# Altium project DCDCProtoNeg.PrjPCB
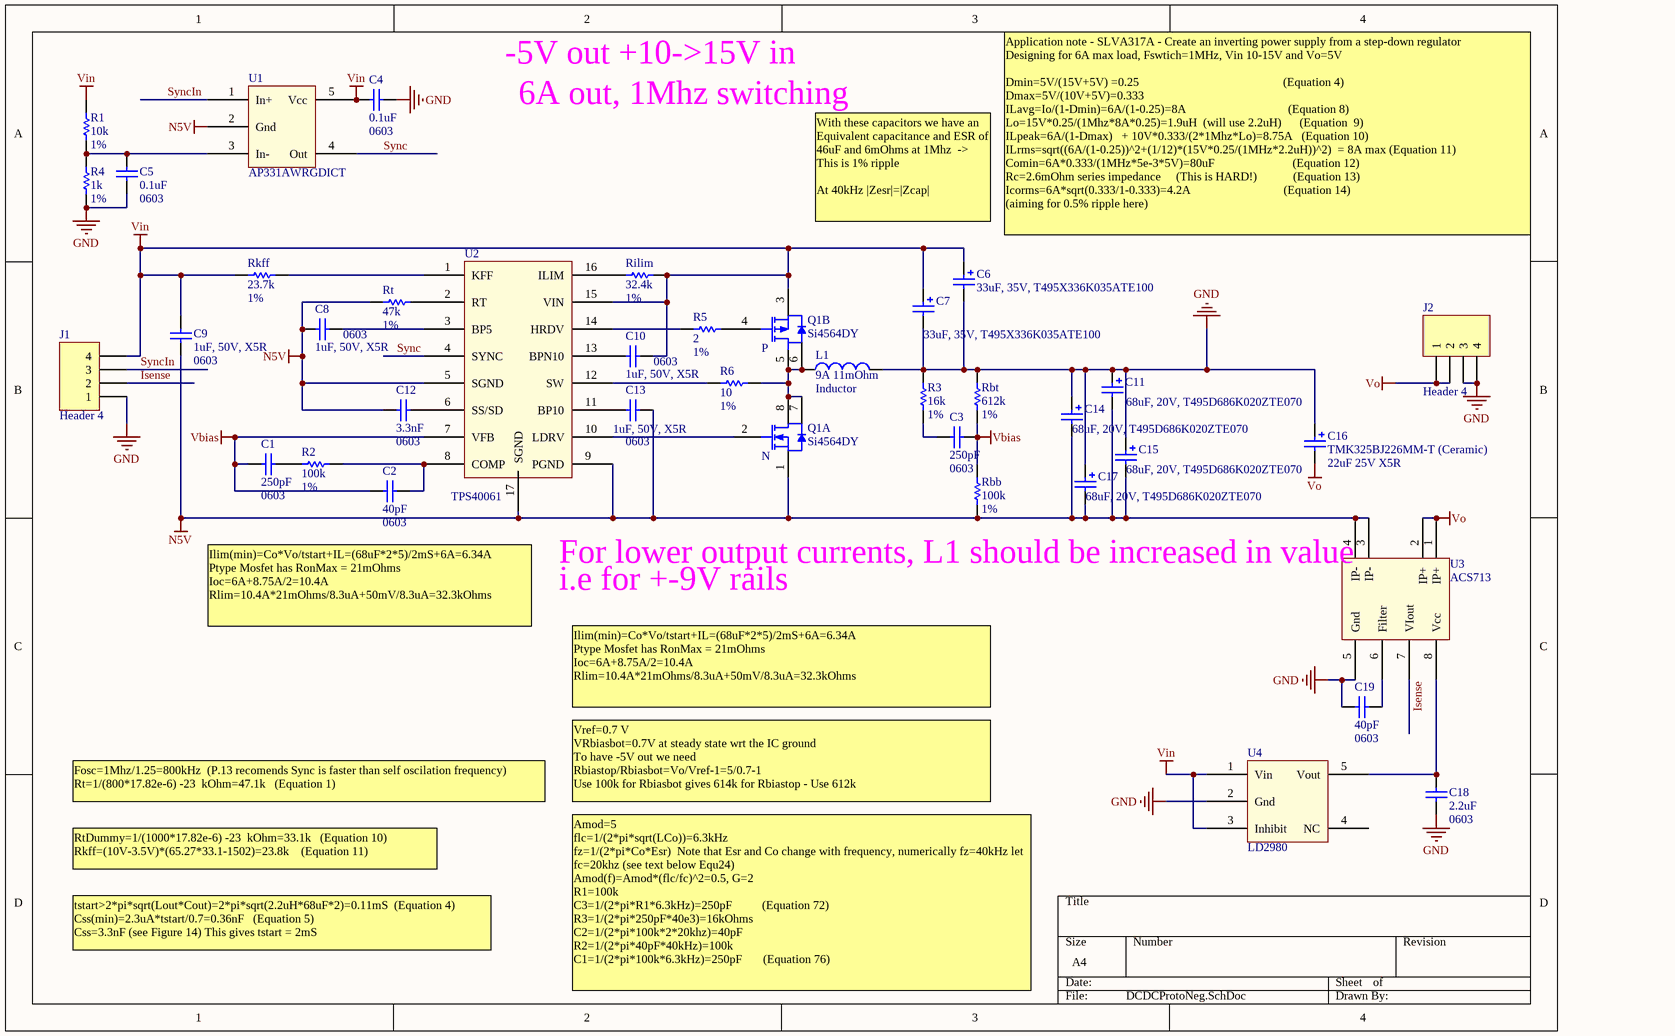
[diagram p0: DCDCProtoNeg.SchDoc]
1 sheet, 38 parts. Net scope: global (net labels, ports and power ports of the same name join across sheets).
Board file: DCDCProtoNeg.PcbDoc

## Sheet DCDCProtoNeg.SchDoc
size A4

### Parts
C1  250pF  [0603]
C2  40pF  [0603]
C3  250pF  [0603]
C4  0.1uF  [0603]
C5  0.1uF  [0603]
C6  33uF, 35V, T495X336K035ATE100  [TCASE-D]
C7  33uF, 35V, T495X336K035ATE100  [TCASE-D]
C8  1uF, 50V, X5R  [0603]
C9  1uF, 50V, X5R  [0603]
C10  1uF, 50V, X5R  [0603]
C11  68uF, 20V, T495D686K020ZTE070  [TCASE-D]
C12  3.3nF  [0603]
C13  1uF, 50V, X5R  [0603]
C14  68uF, 20V, T495D686K020ZTE070  [TCASE-D]
C15  68uF, 20V, T495D686K020ZTE070  [TCASE-D]
C16  TMK325BJ226MM-T (Ceramic)  value 22uF 25V X5R  [1210]
C17  68uF, 20V, T495D686K020ZTE070  [TCASE-D]
C18  2.2uF  [0603]
C19  40pF  [0603]
J1  Header 4  [CON4M]
J2  Header 4  [CON4M]
L1  Inductor  [Wurth744311220]
Q1  Si4564DY  [SO8]  (parts A,B of 2)
R1  value 10k  Param: 1%  [0603]  (hidden comment: Res0603)
R2  value 100k  Param: 1%  [0603]  (hidden comment: Res0603)
R3  value 16k  Param: 1%  [0603]  (hidden comment: Res0603)
R4  value 1k  Param: 1%  [0603]  (hidden comment: Res0603)
R5  value 2  Param: 1%  [0603]  (hidden comment: Res0603)
R6  value 10  Param: 1%  [0603]  (hidden comment: Res0603)
Rbb  value 100k  Param: 1%  [0603]  (hidden comment: Res0603)
Rbt  value 612k  Param: 1%  [0603]  (hidden comment: Res0603)
Rilim  value 32.4k  Param: 1%  [0603]  (hidden comment: Res0603)
Rkff  value 23.7k  Param: 1%  [0603]  (hidden comment: Res0603)
Rt  value 47k  Param: 1%  [0603]  (hidden comment: Res0603)
U1  AP331AWRGDICT  [SOT23-5]
U2  TPS40061  [TSOP65P640X120_HS-16N]
U3  ACS713  [SO8]
U4  LD2980  [SOT23-5]

### Nets
GND: C4.2 C5.1 C6.2 C7.2 C11.1 C14.1 C15.1 C16.1 C17.1 C18.1 C19.2 J1.1 J2.3 J2.4 L1.2 R3.2 R4.1 Rbt.2 U3.5(Gnd) U4.2(Gnd)
N5V: C8.2 C9.1 C11.2 C12.1 C13.2 C14.2 C15.2 C17.2 Q1.1(S1) Rbb.1 Rt.1 U1.2(Gnd) U2.5(SGND) U2.9(PGND) U2.17(SGND) U3.3(IP-) U3.4(IP-)
Vbias: C1.2 C2.2 C3.1 Rbb.2 Rbt.1 U2.7(VFB)
Vin: C4.1 C6.1 C7.1 C9.2 C10.1 J1.4 Q1.3(S2) R1.2 Rilim.2 Rkff.1 U1.5(Vcc) U2.15(VIN) U4.1(Vin) U4.3(Inhibit)
Vo: C16.2 J2.1 J2.2 U3.1(IP+) U3.2(IP+)
Isense: J1.2 U3.7(VIout)
Sync: U1.4(Out) U2.4(SYNC)
SyncIn: J1.3 U1.1(In+)
NetC1_1: C1.1 R2.2
NetC2_1: C2.1 R2.1 U2.8(COMP)
NetC3_2: C3.2 R3.1
NetC5_2: C5.2 R1.1 R4.2 U1.3(In-)
NetC8_1: C8.1 U2.3(BP5)
NetC10_2: C10.2 U2.13(BPN10)
NetC12_2: C12.2 U2.6(SS/SD)
NetC13_1: C13.1 U2.11(BP10)
NetC18_2: C18.2 U3.8(Vcc) U4.5(Vout)
NetC19_1: C19.1 U3.6(Filter)
NetL1_1: L1.1 Q1.5(D2) Q1.6(D2) Q1.7(D1) Q1.8(D1) R6.2
NetQ1_2: Q1.2(G1) U2.10(LDRV)
NetQ1_4: Q1.4(G2) R5.2
NetR5_1: R5.1 U2.14(HRDV)
NetR6_1: R6.1 U2.12(SW)
NetRilim_1: Rilim.1 U2.16(ILIM)
NetRkff_2: Rkff.2 U2.1(KFF)
NetRt_2: Rt.2 U2.2(RT)

Not connected (* = marked no-connect by the designer): U4 4(NC)

### Notes on the sheet
- -5V out +10->15V in
- 6A out, 1Mhz switching
- With these capacitors we have an Equivalent capacitance and ESR of 46uF and 6mOhms at 1Mhz  -> This is 1% ripple
  At 40kHz |Zesr|=|Zcap|
- Application note - SLVA317A - Create an inverting power supply from a step-down regulator
  Designing for 6A max load, Fswtich=1MHz, Vin 10-15V and Vo=5V
  Dmin=5V/(15V+5V) =0.25                                                (Equation 4)
  Dmax=5V/(10V+5V)=0.333
  ILavg=Io/(1-Dmin)=6A/(1-0.25)=8A                                  (Equation 8)
  Lo=15V*0.25/(1Mhz*8A*0.25)=1.9uH  (will use 2.2uH)      (Equation  9)
  ILpeak=6A/(1-Dmax)   + 10V*0.333/(2*1Mhz*Lo)=8.75A   (Equation 10)
  ILrms=sqrt((6A/(1-0.25))^2+(1/12)*(15V*0.25/(1MHz*2.2uH))^2)  = 8A max (Equation 11)
  Comin=6A*0.333/(1MHz*5e-3*5V)=80uF                          (Equation 12)
  Rc=2.6mOhm series impedance     (This is HARD!)            (Equation 13)
  Icorms=6A*sqrt(0.333/1-0.333)=4.2A                               (Equation 14)
  (aiming for 0.5% ripple here)
- (near U3) For lower output currents, L1 should be increased in value
- Ilim(min)=Co*Vo/tstart+IL=(68uF*2*5)/2mS+6A=6.34A
  Ptype Mosfet has RonMax = 21mOhms
  Ioc=6A+8.75A/2=10.4A
  Rlim=10.4A*21mOhms/8.3uA+50mV/8.3uA=32.3kOhms
- i.e for +-9V rails
- Fosc=1Mhz/1.25=800kHz  (P.13 recomends Sync is faster than self oscilation frequency)
  Rt=1/(800*17.82e-6) -23  kOhm=47.1k   (Equation 1)
- Vref=0.7 V
  VRbiasbot=0.7V at steady state wrt the IC ground
  To have -5V out we need
  Rbiastop/Rbiasbot=Vo/Vref-1=5/0.7-1
  Use 100k for Rbiasbot gives 614k for Rbiastop - Use 612k
- RtDummy=1/(1000*17.82e-6) -23  kOhm=33.1k   (Equation 10)
  Rkff=(10V-3.5V)*(65.27*33.1-1502)=23.8k    (Equation 11)
- tstart>2*pi*sqrt(Lout*Cout)=2*pi*sqrt(2.2uH*68uF*2)=0.11mS  (Equation 4)
  Css(min)=2.3uA*tstart/0.7=0.36nF   (Equation 5)
  Css=3.3nF (see Figure 14) This gives tstart = 2mS
- Amod=5
  flc=1/(2*pi*sqrt(LCo))=6.3kHz
  fz=1/(2*pi*Co*Esr)  Note that Esr and Co change with frequency, numerically fz=40kHz let fc=20khz (see text below Equ24)
  Amod(f)=Amod*(flc/fc)^2=0.5, G=2
  R1=100k
  C3=1/(2*pi*R1*6.3kHz)=250pF          (Equation 72)
  R3=1/(2*pi*250pF*40e3)=16kOhms
  C2=1/(2*pi*100k*2*20khz)=40pF
  R2=1/(2*pi*40pF*40kHz)=100k
  C1=1/(2*pi*100k*6.3kHz)=250pF       (Equation 76)
- (in symbol Si4564DY, part A) N
- (in symbol Si4564DY, part B) P
- (in symbol Wurth744311220) 9A 11mOhm

### Library data of the parts
C1-C3 C12 C19 = Cap0603: Capacitor, Ceramic, 0603; TechInf: *; Param1: *
C4 C5 C9 C18 = Cap0603: UMK107BJ105KA-T; TechInf: *; Param1: *
C6 C7 C11 C14 C15 C17 = CapPol3: CAP TANT 68UF 20V 10% 2917 70mOhm; Manufacturer: Kemet; Footprint: 7343-31 (EIA)
  C6 C7: Manufacturers P/N: T495X336K035ATE100
  C11 C14 C15 C17: Manufacturers P/N: T495D686K020ZTE070
C8 C10 C13 = Cap0603: Capacitor, Ceramic, 0603 - UMK107BJ105KA-T; TechInf: *; Param1: *
C16 = Cap Pol3: CAP CER 100UF 10V X5R 1210 20%; Manufacturer: Taiyo Yuden; Manufacturers P/N: LMK325BJ107MM-T; Published: 8-Jun-2000; Publisher: Altium Limited; PackageDescription: Chip Capacitor
J1 J2 = Header 4: Header, 0.1"  4-Pin straight; LatestRevisionDate: 17-Jul-2002; LatestRevisionNote: Re-released for DXP Platform.; Publisher: Altium Limited
L1 = Wurth744311220
R1-R6 Rbb Rbt Rilim Rkff Rt = Res0603: Resistor; Param1: 100ppm/C; TechInfo: *
U2 = TPS40061PWPR: Buck Controller
U3 = ACS713: Hall effect current sensor 0-20A
U4 = LD2980: Regulator